# EAGLE design Neo7m_eval_board (EAGLE 8.2.2)
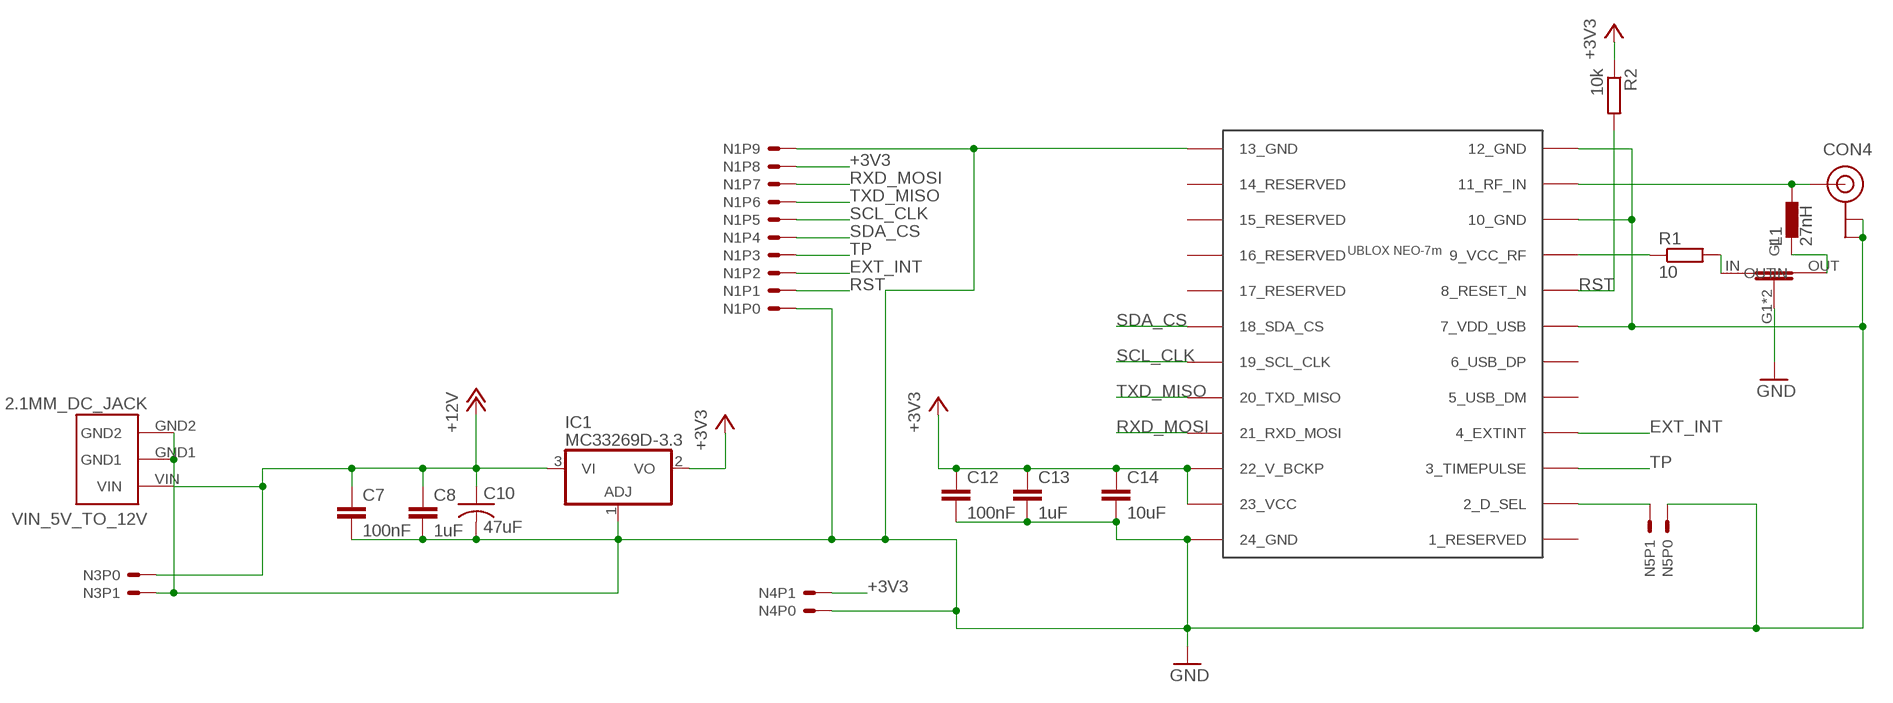
[diagram p0: schematic, sheet 1]

## Parts
C7  100nF  C-EUC1206  [C1206]
C8  1uF  C-EUC1206  [C1206]
C10  47uF  47UF_AL_SMD  [47UF_AL_SMD]
C12  100nF  C-EUC1206  [C1206]
C13  1uF  C-EUC1206  [C1206]
C14  10uF  C-EUC1206  [C1206]
CON4  U.FL  [U.FL]
IC1  MC33269D-3.3  [DPACK]
L1  27nH  BLM15HB221SN1  [0402]
N1  10PINHEADER  [10PINHEADER]
N3  2PINHEADER  [2PINHEADER]
N4  2PINHEADER  [2PINHEADER]
N5  2PINHEADER  [2PINHEADER]
R1  10  R-EU_R1206  [R1206]
R2  10k  R-EU_R1206  [R1206]
U$1  FEEDTHRU_CAP_1206  [FEEDTHRU_CAP_1206]
U$4  UBLOX_NEO7M  [UBLOX_NEO7M]
VIN_5V_TO_12V  2.1MM_DC_JACK  [2.1MM_DC_JACK]

## Nets
+3V3: C12.1 C13.1 C14.1 IC1.2(VO) N1.P8 N4.P1 R2.1 U$4.22_V_BCKP U$4.23_VCC
+12V: C7.1 C8.1 C10.P$1 IC1.3(VI) N3.P0 VIN_5V_TO_12V.VIN
EXT_INT: N1.P2 U$4.4_EXTINT
GND: C7.2 C8.2 C10.P$2 C12.2 C13.2 C14.2 CON4.P$1(GND) CON4.P$2(GND) IC1.1(ADJ) N1.P0 N1.P9 N3.P1 N4.P0 N5.P0 U$1.G1 U$1.G2(G1) U$4.7_VDD_USB U$4.10_GND U$4.12_GND U$4.13_GND U$4.24_GND VIN_5V_TO_12V.GND1 VIN_5V_TO_12V.GND2
N$1: R1.2 U$1.IN
N$2: R1.1 U$4.9_VCC_RF
N$3: L1.1 U$1.OUT
N$7: N5.P1 U$4.2_D_SEL
N$11: CON4.P$3(SIGNAL) L1.2 U$4.11_RF_IN
RST: N1.P1 R2.2 U$4.8_RESET_N
RXD_MOSI: N1.P7 U$4.21_RXD_MOSI
SCL_CLK: N1.P5 U$4.19_SCL_CLK
SDA_CS: N1.P4 U$4.18_SDA_CS
TP: N1.P3 U$4.3_TIMEPULSE
TXD_MISO: N1.P6 U$4.20_TXD_MISO
Unconnected: U$4.1_RESERVED U$4.5_USB_DM U$4.6_USB_DP U$4.14_RESERVED U$4.15_RESERVED U$4.16_RESERVED U$4.17_RESERVED

## Library data of the parts
C7 C8 C12-C14 = rcl:C-EU: CAPACITOR, European symbol
C10 = ForceTronics:47UF_AL_SMD: 47uF Aluminum Electrolytic Cap SMD. Manufacturer part # EMVA250ADA470MF55G
CON4 = SparkFun-Connectors:U.FL: SMD Antenna Connector - U.FL 2mm height, 3.0mm x 3.0mm receptacle size. SparkFun Products: SparkFun WiFi Shield - ESP8266 <https://www.sparkfun.com/products/13287> SparkFun ESP8266 Thing <â€https://www.sparkfun.com/products/13231â€> SparkFun MiniGen - Pro Mini Signal Generator Shield <â€https://www.sparkfun.com/products/11420â€>; PROD_ID: CONN-09193; SF_ID: WRL-09144
IC1 = linear:MC33269?*: Adjustable Output Low Dropout Voltage Regulator 800 mA Source: http://www.onsemi.com/pub/Collateral/MC33269-D.PDF
L1 = inductors:BLM15H: EMIFIL (R) Chip Ferrite Bead for GHz Noise Source: http://www.murata.com/ Ferrite Bead BLM15H.pdf
N1 = ForceTronics:10PINHEADER
N3-N5 = ForceTronics:2PINHEADER
R1 R2 = rcl:R-EU_: RESISTOR, European symbol
U$1 = ForceTronics:FEEDTHRU_CAP_1206: Three terminal feed through capacitor for RF applications 1206. Using following model: http://datasheets.avx.com/AVX-Auto-W2FW3F.pdf
U$4 = ForceTronics:UBLOX_NEO7M: Ublox Neo-7m GPS SoC
VIN_5V_TO_12V = ForceTronics:2.1MM_DC_JACK: Male DC Jack 2.1mm

## Board
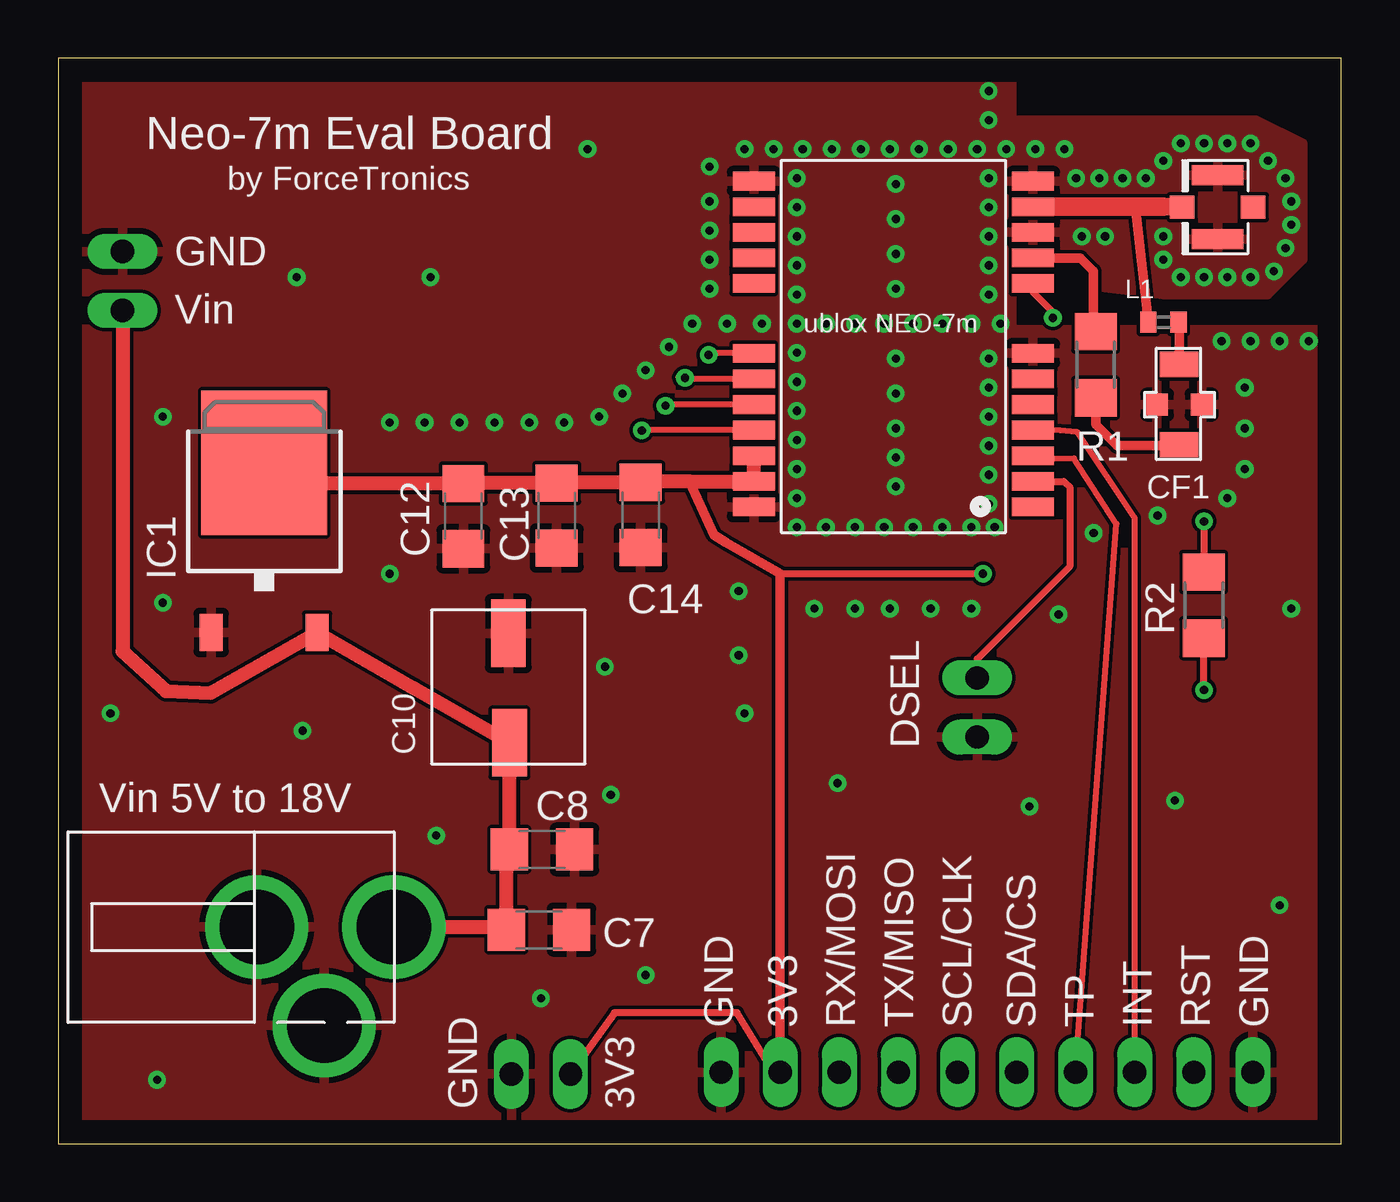
[diagram p1: board, top side]
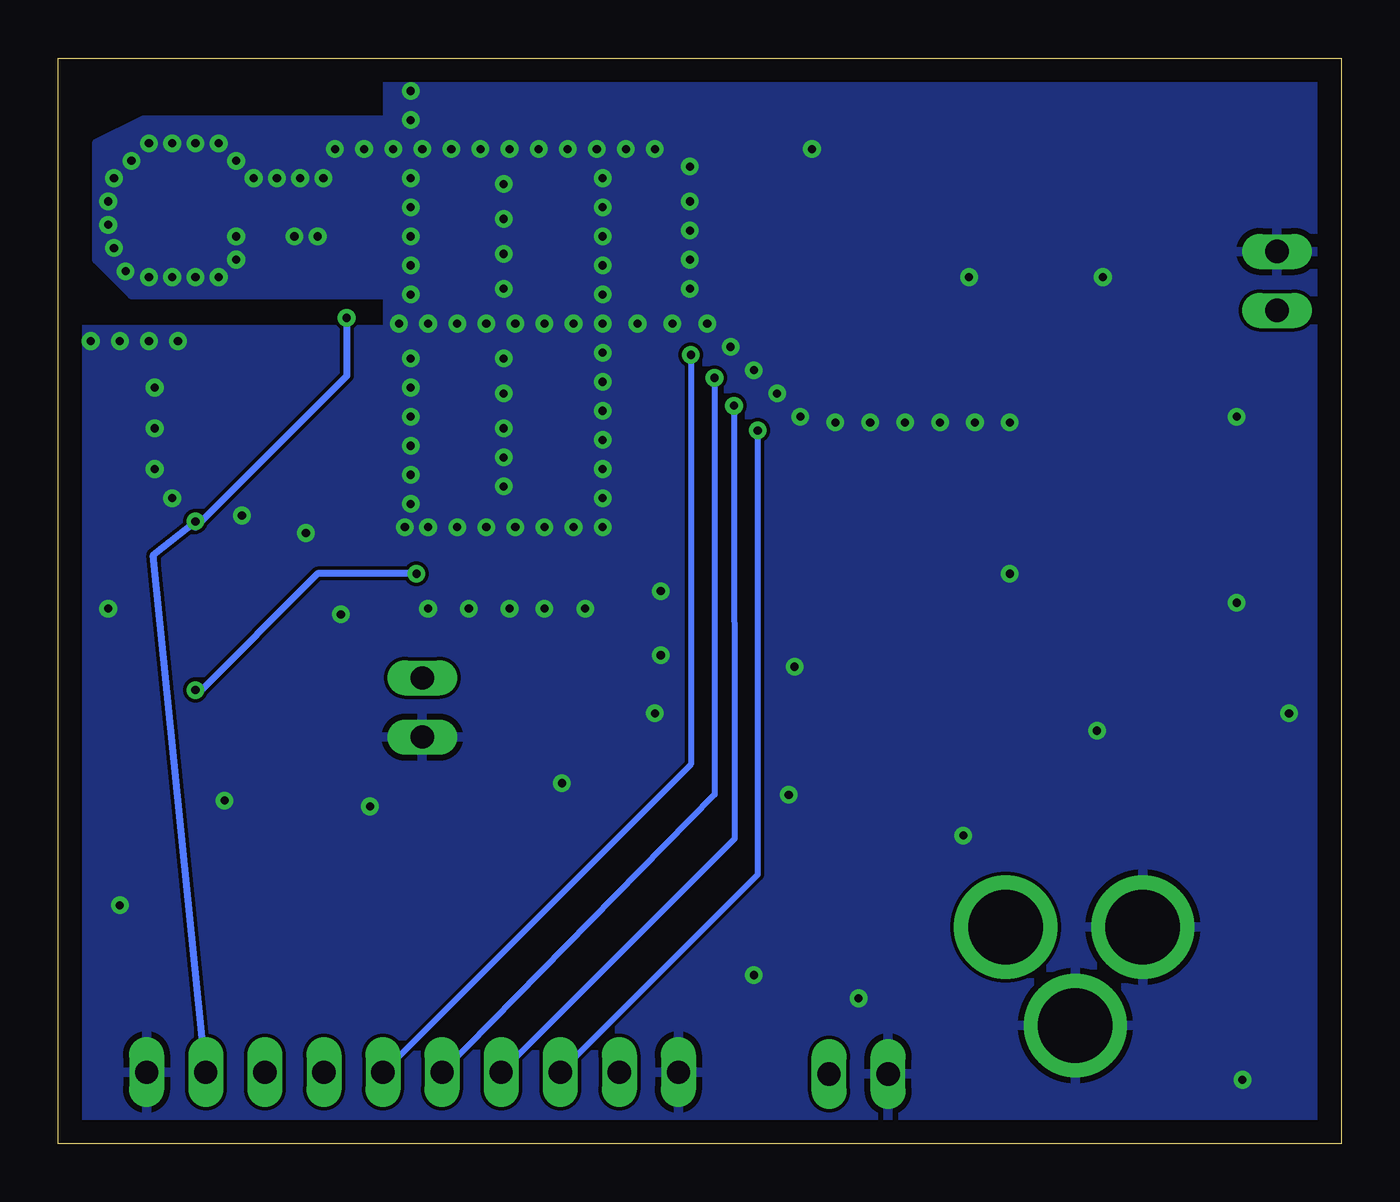
[diagram p2: board, bottom side, seen from below]

Size 55.15 x 46.66 mm. Coordinates in mm from the lower left corner, seen from the top.
Outline: 0,0 55.15,0 55.15,46.66 0,46.66 0,0
Copper layers (1*16): Top 0.035mm / dielectric 1.5mm / Bottom 0.035mm
Design rules "default": minimum track width 6mil, minimum drill 0.35mm, track to track 6mil, track to pad 6mil, pad to pad 6mil, via to via 6mil, smd to smd 6mil, copper to edge 40mil, drill to drill 6mil, minimum pad ring 10mil, minimum via ring 8mil, stop-mask expansion 4mil, vias tented up to drill 0mil, thermal gap 10mil

### Footprints (pad centres in the part's own frame; a part is rotated, then mirrored left to right if it is on the bottom)
C1206 = smd 1.6 x 1.8: 1 -1.4,0; 2 1.4,0
47UF_AL_SMD = smd 2.9 x 1.5: P$1 0.9,3.25; P$2 5.6,3.3
U.FL = smd 2.2 x 0.85: P$1 0,1.375; P$2 0,-1.375 | smd 1.05 x 1: P$3 1.525,0; P$4 -1.525,0
DPACK = smd 1 x 1.6: 1 -2.28,-4.8; 3 2.28,-4.8 | smd 5.4 x 6.2: 2 0,2.5
0402 = smd 0.7 x 0.9: 1 -0.65,0; 2 0.65,0
10PINHEADER = drill 1 long: P0 1.27,-3.81; P1 3.81,-3.81; P2 6.35,-3.81; P3 8.89,-3.81; P4 11.43,-3.81; P5 13.97,-3.81; P6 16.51,-3.81; P7 19.05,-3.81; P8 21.59,-3.81; P9 24.13,-3.81
2PINHEADER = drill 1 long: P0 -1.27,0; P1 1.27,0
R1206 = smd 1.6 x 1.803: 1 -1.422,0; 2 1.422,0
FEEDTHRU_CAP_1206 = smd 0.94 x 0.94: G1 2.27,1.77; G2 2.27,-0.15 | smd 1.09 x 1.65: IN 0.55,0.83; OUT 4,0.82
UBLOX_NEO7M = smd 1.8 x 0.8: 1_RESERVED 10.769,1.134; 2_D_SEL 10.769,2.234; 3_TIMEPULSE 10.769,3.334; 4_EXTINT 10.769,4.434; 5_USB_DM 10.769,5.534; 6_USB_DP 10.769,6.634; 7_VDD_USB 10.769,7.734; 8_RESET_N 10.769,10.734; 9_VCC_RF 10.769,11.834; 10_GND 10.769,12.934; 11_RF_IN 10.769,14.034; 12_GND 10.769,15.134; 13_GND -1.231,15.134; 14_RESERVED -1.231,14.034; 15_RESERVED -1.231,12.934; 16_RESERVED -1.231,11.834; 17_RESERVED -1.231,10.734; 18_SDA_CS -1.231,7.734; 19_SCL_CLK -1.231,6.634; 20_TXD_MISO -1.231,5.534; 21_RXD_MOSI -1.231,4.434; 22_V_BCKP -1.231,3.334; 23_VCC -1.231,2.234; 24_GND -1.231,1.134
2.1MM_DC_JACK = drill 3.2 pad 4.445: GND1 4.1,8.1; GND2 8.327,11; VIN 4.1,14

### Placement (x,y rotation side)
C7  20.67,9.19 0 top
C8  20.79,12.65 0 top
C10  22.65,16.33 90 top
C12  17.41,26.97 270 top
C13  21.43,27 270 top
C14  25.04,27.03 270 top
CON4  49.83,40.26 180 top
IC1  8.86,26.77 0 top
L1  47.51,35.31 180 top
N1  52.62,-0.74 180 top
N3  2.77,37.08 90 top
N4  20.75,3 0 top
N5  39.5,18.75 90 top
R1  44.59,33.48 270 top
R2  49.24,23.15 90 top
U$1  49,29.5 90 top
U$4  31.13,26.24 0 top
VIN_5V_TO_12V  0.43,13.41 270 top

### Tracks (layer width: path | path; a pad name or v marks a point on that pad's centre or on a via)
+3V3  (via drill 0.35)
  Top 0.305: 31.03,24.51 39.74,24.51 v39.75,24.5 | v49.25,19.5 R2.1 | N1.P8 30.74,3.07 29.18,5.64 23.91,5.64 N4.P1
  Top 0.406: 27.13,28.47 28.2,26.16 28.7,25.85 31.03,24.51 N1.P8
  Top 0.61: IC1.2 9.75,28.38 C12.1 17.44,28.4 C13.1 21.45,28.43 C14.1 25.08,28.47 27.13,28.47 U$4.23_VCC U$4.22_V_BCKP
  Bottom 0.305: v39.75,24.5 44,24.5 49.25,19.25 v49.25,19.5
+12V
  Top 0.61: VIN_5V_TO_12V.VIN 19.15,9.31 C7.1 19.27,12.52 C8.1 C10.P$1 15.29,19.57 IC1.3 6.56,19.38 4.63,19.46 2.77,21.16 N3.P0
EXT_INT
  Top 0.254: U$4.4_EXTINT 43.06,30.66 43.81,30.58 46.27,26.9 N1.P2
GND  (via drill 0.35)
  other vias: 45,39 43.75,41.5 44.75,41.5 45.75,41.5 46.75,41.5 47.5,42.25 48.25,43 49.25,43 50.25,43 51.25,43 52,42.25 52.75,41.5 53,40.5 53,39.5 52.75,38.5 52.25,37.5 51.25,37.25 50.25,37.25 49.25,37.25 48.25,37.25 47.5,38 47.5,39 44,39 43.25,42.75 42,42.75 40.75,42.75 39.5,42.75 38.25,42.75 37,42.75 35.75,42.75 34.5,42.75 33.25,42.75 32,42.75 30.75,42.75 29.5,42.75 31.75,41.5 31.75,40.25 31.75,39 31.75,37.75 31.75,36.5 31.75,35.25 30.25,35.25 33,35.25 34.25,35.25 35.5,35.25 36.75,35.25 38,35.25 39.25,35.25 40.5,35.25 31.75,34 31.75,32.75 31.75,31.5 31.75,30.25 31.75,29 31.75,27.75 31.75,26.5 33,26.5 34.25,26.5 35.5,26.5 36.75,26.5 38,26.5 39.25,26.5 40.25,26.5 40,27.5 40,28.75 40,30 40,31.25 40,32.5 40,33.75 40,36.5 40,37.75 40,39 40,40.25 40,41.5 28.75,35.25 27.25,35.25 26.25,34.25 25.25,33.25 24.25,32.25 23.25,31.25 21.75,31 20.25,31 18.75,31 17.25,31 15.75,31 14.25,31 28,36.75 28,38 28,39.25 28,40.5 28,42 51,32.5 50,34.5 51.25,34.5 52.5,34.5 53.75,34.5 50.25,27.75 47.25,27 44.5,26.25 36,41.25 36,39.75 36,38.25 36,36.75 36,33.75 36,32.25 36,30.75 36,29.5 36,28.25 40,44 40,45.25 51,30.75 16,37.25 22.75,42.75 4.5,31.25 2.25,18.5 10.5,17.75 16.25,13.25 29.25,23.75 23.5,20.5 14.25,24.5 10.25,37.25 4.25,2.75 20.75,6.25 25.25,7.25 48,14.75 41.75,14.5 34.25,23 37.5,23 32.5,23 35.75,23 39.25,23 43,22.75 51,29 53,23 52.5,10.25 29.5,18.5 29.25,21 33.5,15.5 23.75,15 4.5,23.25
  pour Top: -2,-1 -2,48 41,48 41,35 58,35 58,-1
  pour Bottom: -2,-1 -2,48 41,48 41,35 58,35 58,-1
  pour Bottom: 38.5,44 51.5,44 53.5,43 53.5,38 52,36.5 38.5,36.5
  pour Top: 39,44 51.5,44 53.5,43 53.5,38 52,36.5 47.5,36.5 39,37.5
N$1
  Top 0.406: R1.2 44.59,30.91 45.5,30 48.12,30 U$1.IN
N$2
  Top 0.406: U$4.9_VCC_RF 43.93,38.07 44.5,37.5 44.5,35.69 R1.1
N$3
  Top 0.406: U$1.OUT 48.18,35.29 L1.1
N$7
  Top 0.305: U$4.2_D_SEL 43.22,28.47 43.5,28.19 43.5,24.84 39.5,20.84 N5.P1
N$11
  Top 0.254: 48.3,40.27 CON4.P$3
  Top 0.406: L1.2 46.31,40.08 47.51,40.27
  Top 0.75: 47.51,40.27 48.3,40.27
  Top 0.8: 47.51,40.27 U$4.11_RF_IN
RST  (via drill 0.35)
  Top 0.305: U$4.8_RESET_N 41.9,36.6 42.75,35.75 v42.75,35.5 | v49.25,26.75 R2.2
  Bottom 0.305: v42.75,35.5 42.75,33 49.25,26.5 v49.25,26.75 51.06,25.31 N1.P1
RXD_MOSI  (via drill 0.35)
  Top 0.254: U$4.21_RXD_MOSI 24.89,30.67 24.88,30.68 25.06,30.68 v25.09,30.66
  Bottom 0.254: v25.09,30.66 25.09,11.56 N1.P7
SCL_CLK  (via drill 0.35)
  Top 0.254: U$4.19_SCL_CLK 26.78,32.87 26.71,32.94 26.66,32.94 v26.94,32.92
  Bottom 0.254: v26.94,32.92 26.94,15.01 N1.P5
SDA_CS  (via drill 0.35)
  Top 0.254: U$4.18_SDA_CS 28.02,33.97 v27.96,33.91 | v27.96,33.91 27.8,33.76 v27.96,33.91
  Bottom 0.254: v27.96,33.91 27.96,16.31 N1.P4
TP
  Top 0.254: U$4.3_TIMEPULSE 42.78,29.43 43.66,29.46 45.48,26.64 N1.P3
TXD_MISO  (via drill 0.35)
  Top 0.254: U$4.20_TXD_MISO 26.28,31.77 26.2,31.8 26.03,31.8 v26.1,31.73
  Bottom 0.254: v26.1,31.73 26.08,13.11 N1.P6

### Text on the board
tNames: Neo-7m Eval Board | by ForceTronics | GND | Vin | CF1 | DSEL | Vin 5V to 18V | GND | 3V3 | RX/MOSI | TX/MISO | SCL/CLK | SDA/CS | TP | INT | RST | GND | GND | 3V3